# Altium schematic sheet main.SchDoc
size A3
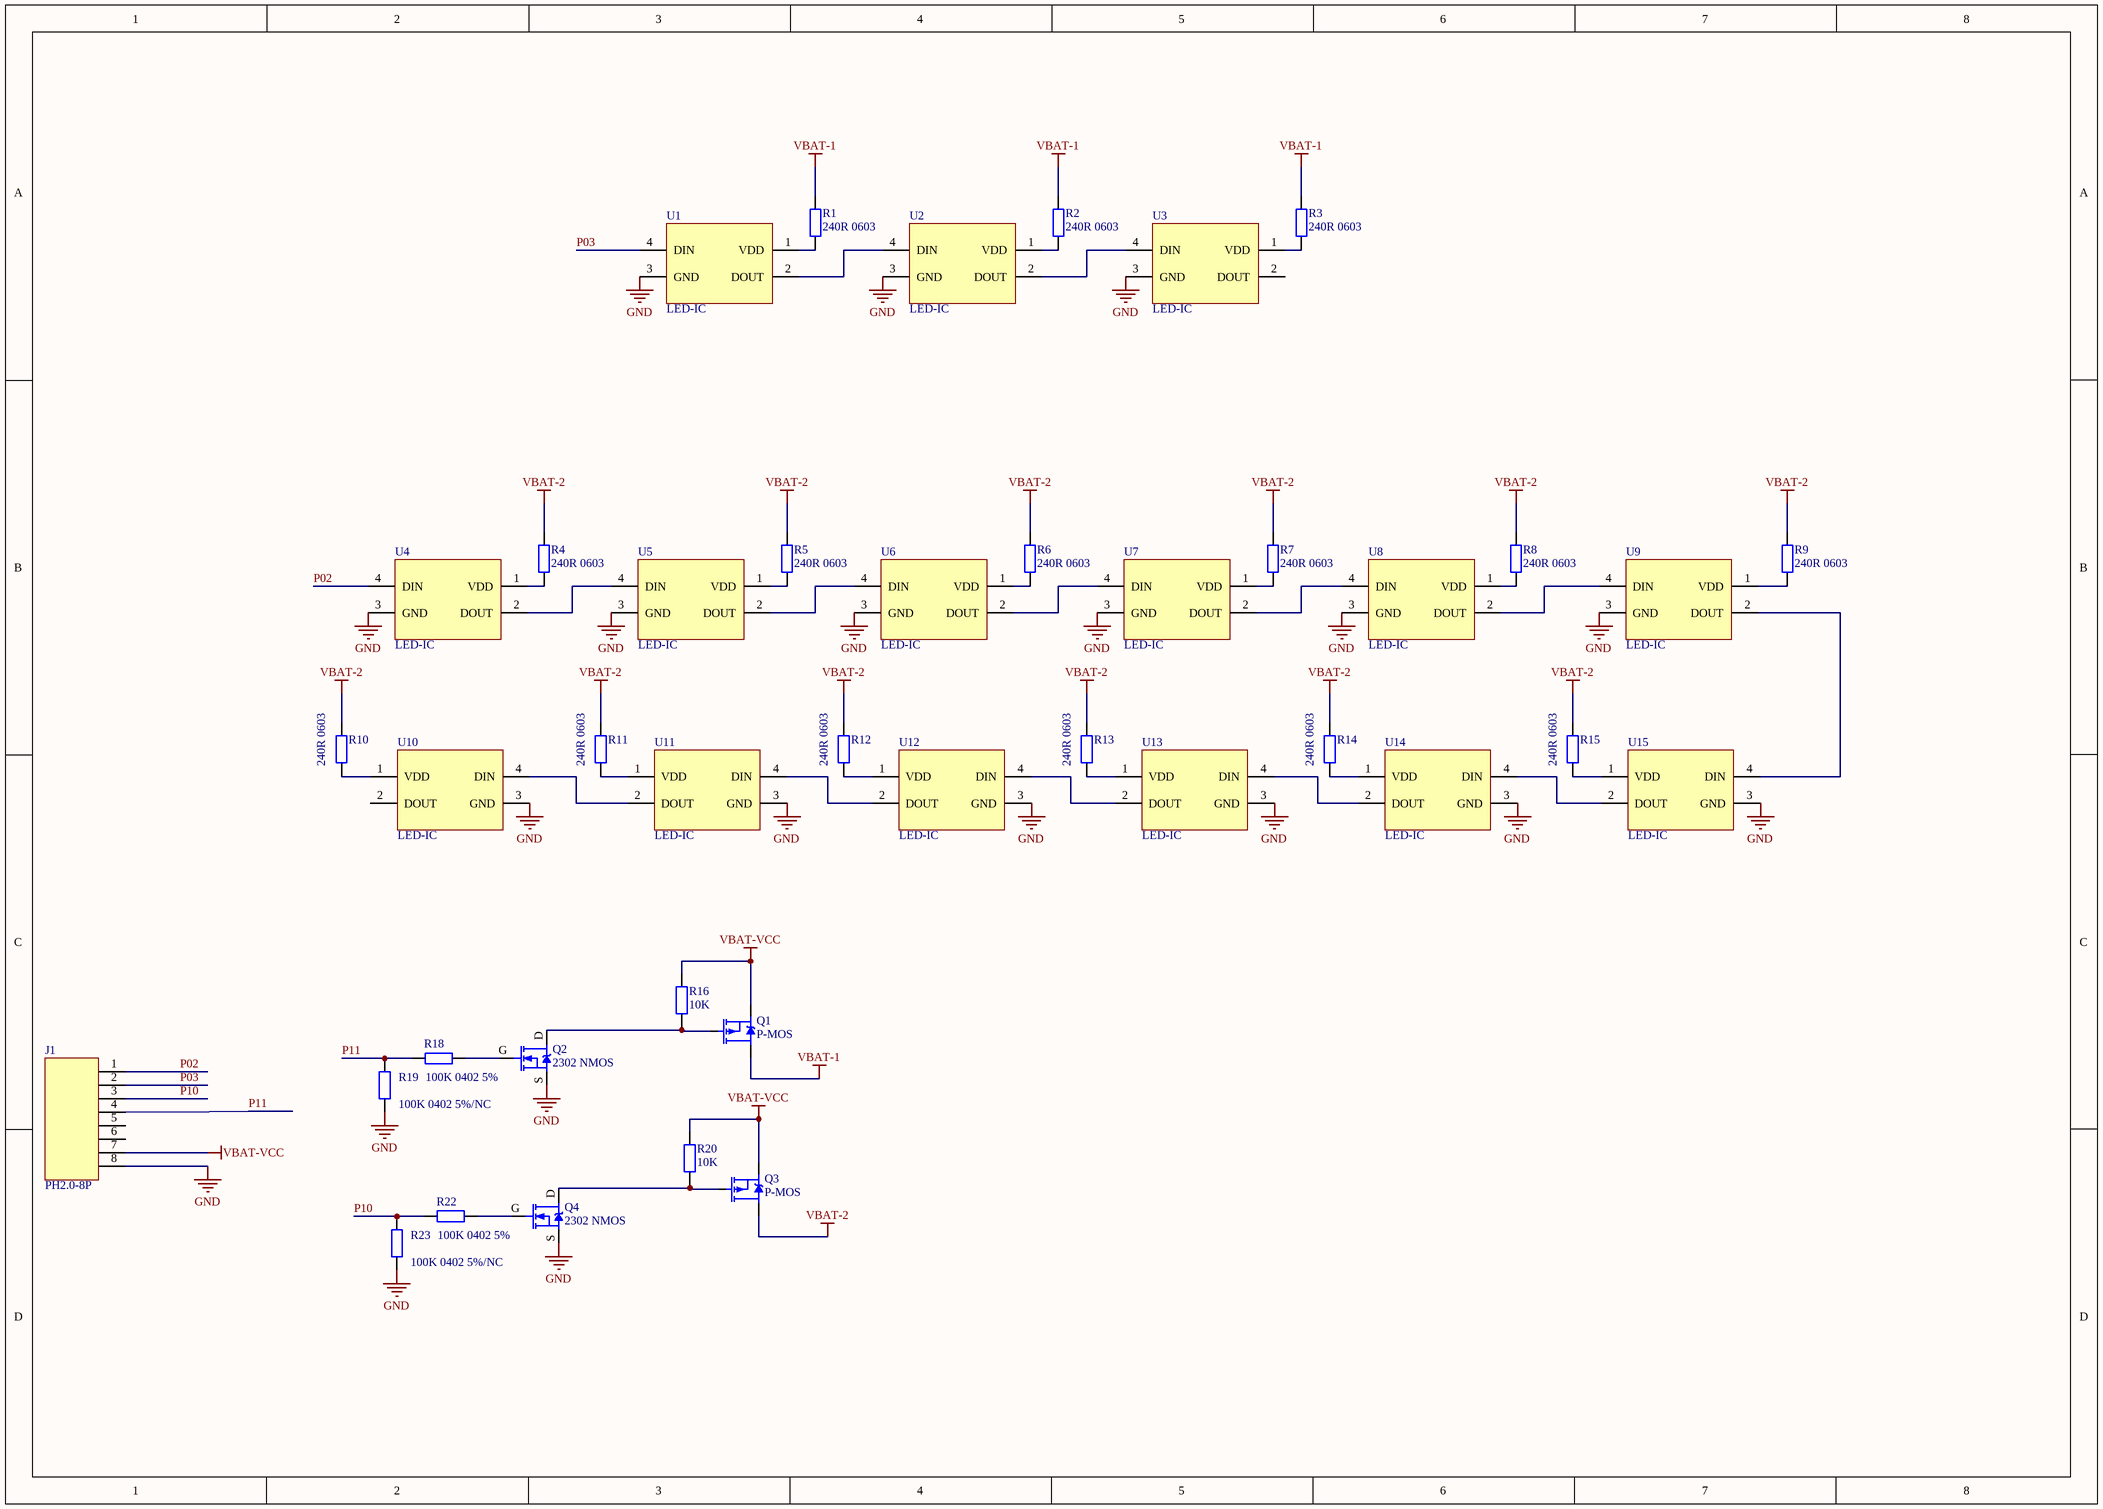
[diagram p0: main.SchDoc]

## Parts
J1  PH2.0-8P  [PH2.0-8P]
Q1  P-MOS  [SOT23]
Q2  2302 NMOS  [SOT23]
Q3  P-MOS  [SOT23]
Q4  2302 NMOS  [SOT23]
R1  240R 0603  [R 0603]
R2  240R 0603  [R 0603]
R3  240R 0603  [R 0603]
R4  240R 0603  [R 0603]
R5  240R 0603  [R 0603]
R6  240R 0603  [R 0603]
R7  240R 0603  [R 0603]
R8  240R 0603  [R 0603]
R9  240R 0603  [R 0603]
R10  240R 0603  [R 0603]
R11  240R 0603  [R 0603]
R12  240R 0603  [R 0603]
R13  240R 0603  [R 0603]
R14  240R 0603  [R 0603]
R15  240R 0603  [R 0603]
R16  10K  [R 0603]
R18  100K 0402 5%  [R 0603]
R19  100K 0402 5%/NC  [R 0603]
R20  10K  [R 0603]
R22  100K 0402 5%  [R 0603]
R23  100K 0402 5%/NC  [R 0603]
U1  LED-IC  [LED-SMD_4P-L5.0-W5.0-BL_TC5050RGB]
U2  LED-IC  [LED-SMD_4P-L5.0-W5.0-BL_TC5050RGB]
U3  LED-IC  [LED-SMD_4P-L5.0-W5.0-BL_TC5050RGB]
U4  LED-IC  [LED-SMD_4P-L5.0-W5.0-BL_TC5050RGB]
U5  LED-IC  [LED-SMD_4P-L5.0-W5.0-BL_TC5050RGB]
U6  LED-IC  [LED-SMD_4P-L5.0-W5.0-BL_TC5050RGB]
U7  LED-IC  [LED-SMD_4P-L5.0-W5.0-BL_TC5050RGB]
U8  LED-IC  [LED-SMD_4P-L5.0-W5.0-BL_TC5050RGB]
U9  LED-IC  [LED-SMD_4P-L5.0-W5.0-BL_TC5050RGB]
U10  LED-IC  [LED-SMD_4P-L5.0-W5.0-BL_TC5050RGB]
U11  LED-IC  [LED-SMD_4P-L5.0-W5.0-BL_TC5050RGB]
U12  LED-IC  [LED-SMD_4P-L5.0-W5.0-BL_TC5050RGB]
U13  LED-IC  [LED-SMD_4P-L5.0-W5.0-BL_TC5050RGB]
U14  LED-IC  [LED-SMD_4P-L5.0-W5.0-BL_TC5050RGB]
U15  LED-IC  [LED-SMD_4P-L5.0-W5.0-BL_TC5050RGB]

## Nets
GND: J1.8 Q2.S Q4.S R19.1 R23.1 U1.3(GND) U2.3(GND) U3.3(GND) U4.3(GND) U5.3(GND) U6.3(GND) U7.3(GND) U8.3(GND) U9.3(GND) U10.3(GND) U11.3(GND) U12.3(GND) U13.3(GND) U14.3(GND) U15.3(GND)
VBAT-1: Q1.D R1.2 R2.2 R3.2
VBAT-2: Q3.D R4.2 R5.2 R6.2 R7.2 R8.2 R9.2 R10.2 R11.2 R12.2 R13.2 R14.2 R15.2
VBAT-VCC: J1.7 Q1.S Q3.S R16.2 R20.2
P02: J1.1 U4.4(DIN)
P03: J1.2 U1.4(DIN)
P10: J1.3 R22.1 R23.2
P11: J1.4 R18.1 R19.2
NetQ1_G: Q1.G Q2.D R16.1
NetQ2_G: Q2.G R18.2
NetQ3_G: Q3.G Q4.D R20.1
NetQ4_G: Q4.G R22.2
NetR1_1: R1.1 U1.1(VDD)
NetR2_1: R2.1 U2.1(VDD)
NetR3_1: R3.1 U3.1(VDD)
NetR4_1: R4.1 U4.1(VDD)
NetR5_1: R5.1 U5.1(VDD)
NetR6_1: R6.1 U6.1(VDD)
NetR7_1: R7.1 U7.1(VDD)
NetR8_1: R8.1 U8.1(VDD)
NetR9_1: R9.1 U9.1(VDD)
NetR10_1: R10.1 U10.1(VDD)
NetR11_1: R11.1 U11.1(VDD)
NetR12_1: R12.1 U12.1(VDD)
NetR13_1: R13.1 U13.1(VDD)
NetR14_1: R14.1 U14.1(VDD)
NetR15_1: R15.1 U15.1(VDD)
NetU1_2: U1.2(DOUT) U2.4(DIN)
NetU2_2: U2.2(DOUT) U3.4(DIN)
NetU4_2: U4.2(DOUT) U5.4(DIN)
NetU5_2: U5.2(DOUT) U6.4(DIN)
NetU6_2: U6.2(DOUT) U7.4(DIN)
NetU7_2: U7.2(DOUT) U8.4(DIN)
NetU8_2: U8.2(DOUT) U9.4(DIN)
NetU9_2: U9.2(DOUT) U15.4(DIN)
NetU10_4: U10.4(DIN) U11.2(DOUT)
NetU11_4: U11.4(DIN) U12.2(DOUT)
NetU12_4: U12.4(DIN) U13.2(DOUT)
NetU13_4: U13.4(DIN) U14.2(DOUT)
NetU14_4: U14.4(DIN) U15.2(DOUT)

Not connected (* = marked no-connect by the designer): J1 5 6; U3 2(DOUT); U10 2(DOUT)

## Library data of the parts
Q1 Q3 = P-MOS: P沟道场效应管
Q2 Q4 = N-MOS: N沟道场效应管
R1-R16 R18-R20 R22 R23 = R: 贴片电阻; 版权归属: 源创客; BOM名称: 贴片电阻; 学习资源: www.ooocke.com
U1-U15 = TC5050RGB